# EAGLE schematic Display-Board_Rack-PDU_1.0 (EAGLE 9.6.2)
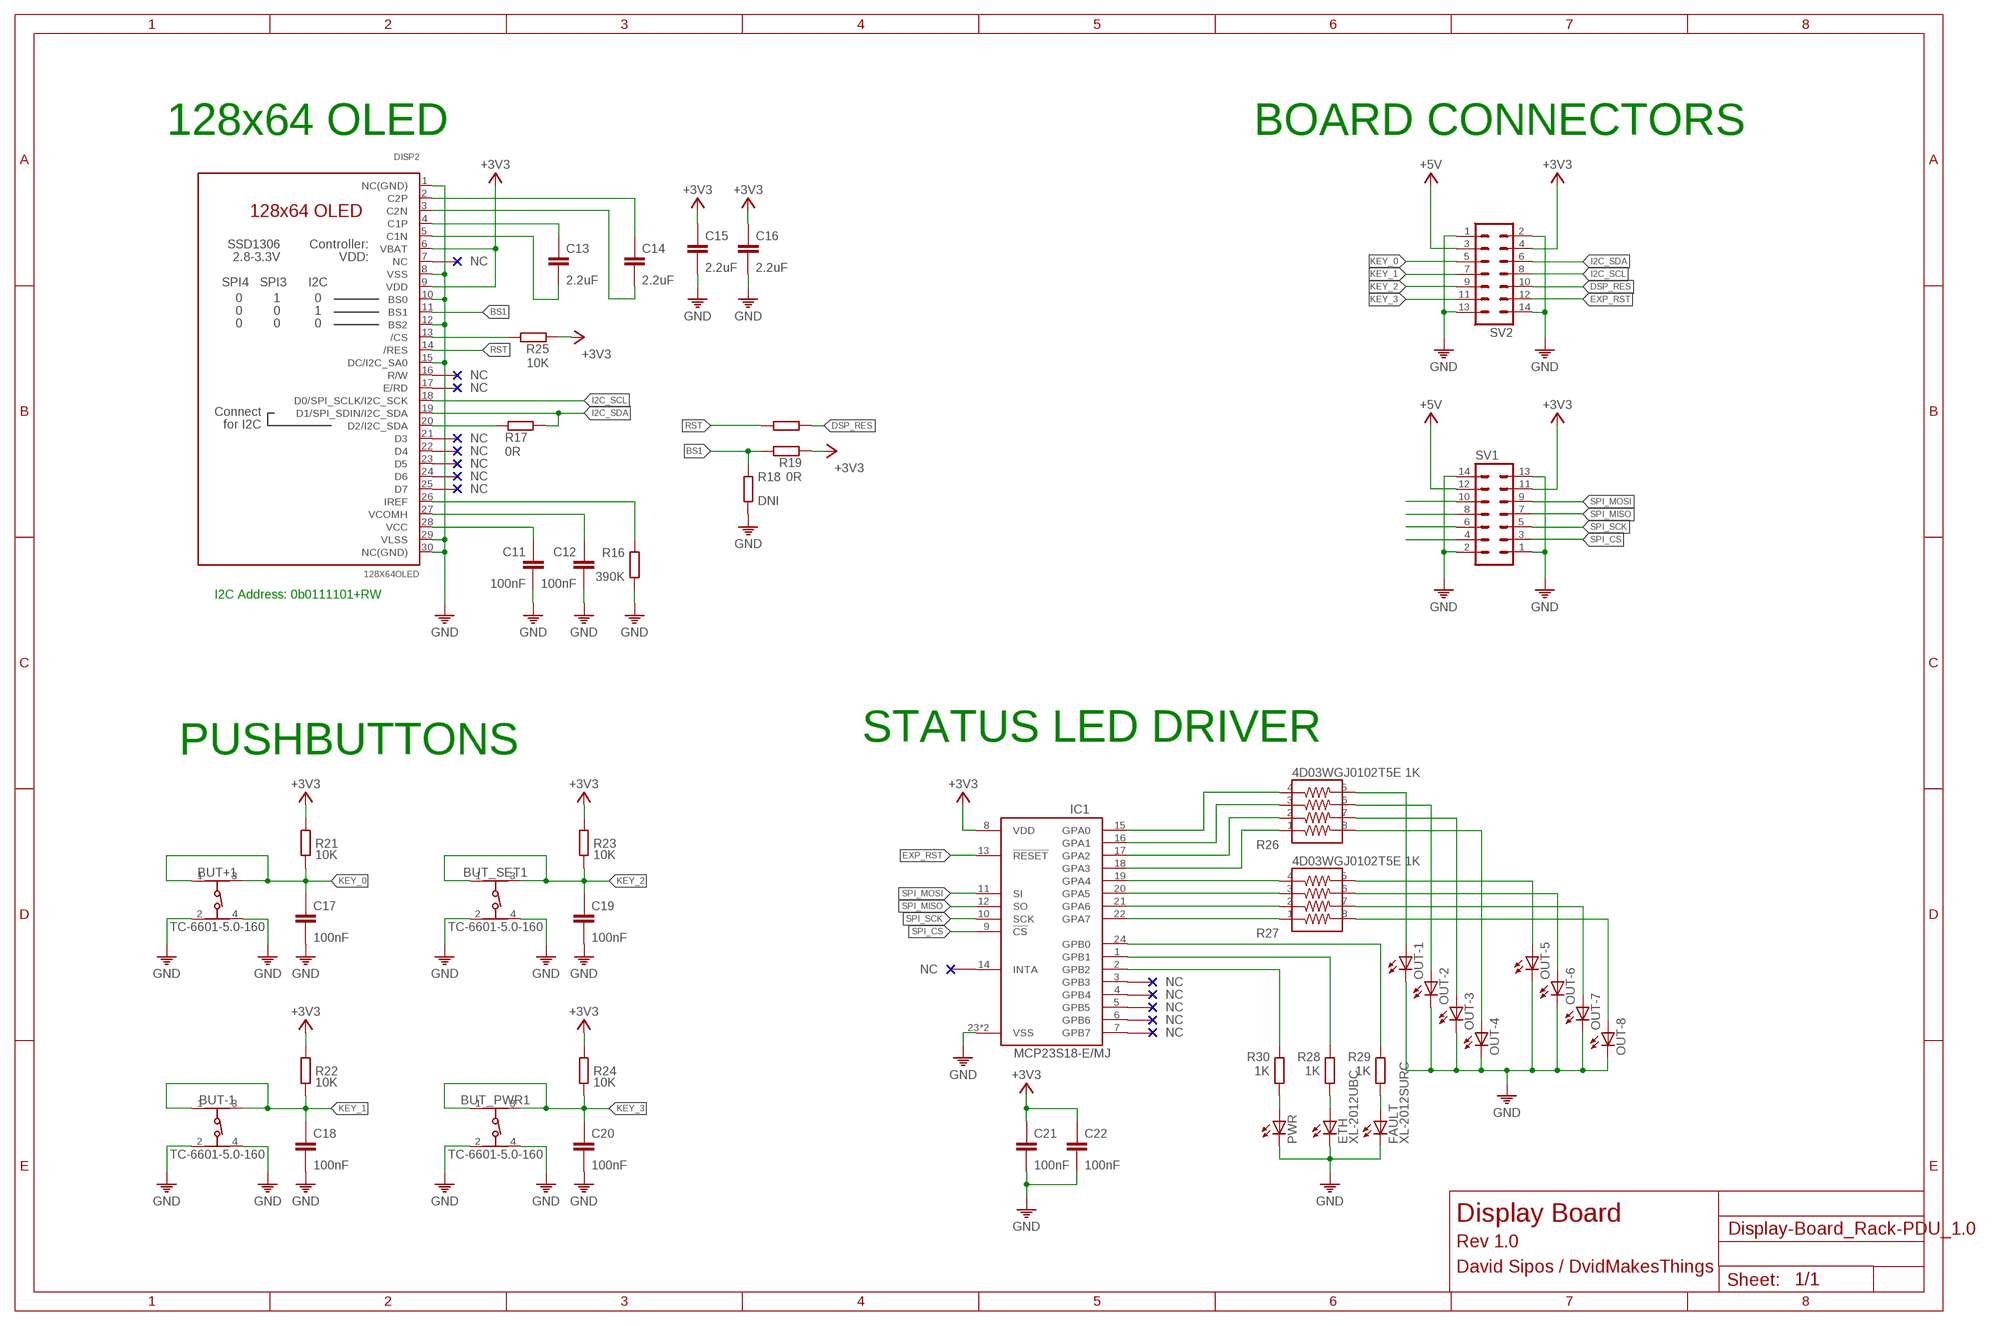
[diagram p0: schematic, sheet 1]

## Parts
BUT+1  TC-6601-5.0-160  430182043816  [430182043816]
BUT-1  TC-6601-5.0-160  430182043816  [430182043816]
BUT_PWR1  TC-6601-5.0-160  430182043816  [430182043816]
BUT_SET1  TC-6601-5.0-160  430182043816  [430182043816]
C11  100nF  C0402  [0402]
C12  100nF  C0402  [0402]
C13  2.2uF  C0402  [0402]
C14  2.2uF  C0402  [0402]
C15  2.2uF  C0402  [0402]
C16  2.2uF  C0402  [0402]
C17  100nF  C0402  [0402]
C18  100nF  C0402  [0402]
C19  100nF  C0402  [0402]
C20  100nF  C0402  [0402]
C21  100nF  C0402  [0402]
C22  100nF  C0402  [0402]
DISP2  128X64OLED  [UG2864]
ETH  XL-2012UBC  LEDCHIP-LED0805  [CHIP-LED0805]
FAULT  XL-2012SURC  LEDCHIP-LED0805  [CHIP-LED0805]
IC1  MCP23S18-E/MJ  MCP23S18  [QFN50P400X400X100-25T265]
OUT-1  LEDCHIP-LED0805  [CHIP-LED0805]
OUT-2  LEDCHIP-LED0805  [CHIP-LED0805]
OUT-3  LEDCHIP-LED0805  [CHIP-LED0805]
OUT-4  LEDCHIP-LED0805  [CHIP-LED0805]
OUT-5  LEDCHIP-LED0805  [CHIP-LED0805]
OUT-6  LEDCHIP-LED0805  [CHIP-LED0805]
OUT-7  LEDCHIP-LED0805  [CHIP-LED0805]
OUT-8  LEDCHIP-LED0805  [CHIP-LED0805]
PWR  LEDCHIP-LED0805  [CHIP-LED0805]
R16  390K  R0402  [0402]
R17  0R  R0402  [0402]
R18  DNI  R0402  [0402]
R19  0R  R0402  [0402]
R20  0R  R0402  [0402]
R21  10K  R0402  [0402]
R22  10K  R0402  [0402]
R23  10K  R0402  [0402]
R24  10K  R0402  [0402]
R25  10K  R0402  [0402]
R26  4D03WGJ0102T5E 1K  742C083103JP  [742C083103JP]
R27  4D03WGJ0102T5E 1K  742C083103JP  [742C083103JP]
R28  1K  R0402  [0402]
R29  1K  R0402  [0402]
R30  1K  R0402  [0402]
SV1  MA07-2W  [MA07-2W]
SV2  MA07-2W  [MA07-2W]

## Nets
+3V3: C15.1 C16.1 C21.1 C22.1 DISP2.6(VBAT) DISP2.9(VDD) IC1.8(VDD) R19.1 R21.1 R22.1 R23.1 R24.1 R25.1 SV1.11 SV2.4
+5V: SV1.12 SV2.3
BS1: DISP2.11(BS1) R18.1 R19.2
DSP_RES: R20.2 SV2.10
EXP_RST: IC1.13(!RESET) SV2.12
GND: BUT+1.2 BUT+1.4 BUT-1.2 BUT-1.4 BUT_PWR1.2 BUT_PWR1.4 BUT_SET1.2 BUT_SET1.4 C11.2 C12.2 C15.2 C16.2 C17.2 C18.2 C19.2 C20.2 C21.2 C22.2 DISP2.1(NC(GND)) DISP2.8(VSS) DISP2.10(BS0) DISP2.12(BS2) DISP2.15(DC/I2C_SA0) DISP2.29(VLSS) DISP2.30(NC(GND)) ETH.C FAULT.C IC1.23(VSS) IC1.25(VSS) OUT-1.C OUT-2.C OUT-3.C OUT-4.C OUT-5.C OUT-6.C OUT-7.C OUT-8.C PWR.C R16.2 R18.2 SV1.1 SV1.2 SV1.13 SV1.14 SV2.1 SV2.2 SV2.13 SV2.14
I2C_SCL: DISP2.18(D0/SPI_SCLK/I2C_SCK) SV2.8
I2C_SDA: DISP2.19(D1/SPI_SDIN/I2C_SDA) R17.2 SV2.6
KEY_0: BUT+1.1 BUT+1.3 C17.1 R21.2 SV2.5
KEY_1: BUT-1.1 BUT-1.3 C18.1 R22.2 SV2.7
KEY_2: BUT_SET1.1 BUT_SET1.3 C19.1 R23.2 SV2.9
KEY_3: BUT_PWR1.1 BUT_PWR1.3 C20.1 R24.2 SV2.11
N$22: C13.2 DISP2.5(C1N)
N$35: C13.1 DISP2.4(C1P)
N$36: C14.2 DISP2.3(C2N)
N$37: C14.1 DISP2.2(C2P)
N$38: DISP2.26(IREF) R16.1
N$39: C11.1 DISP2.28(VCC)
N$40: C12.1 DISP2.27(VCOMH)
N$41: DISP2.20(D2/I2C_SDA) R17.1
N$42: SV1.10
N$43: SV1.8
N$44: SV1.6
N$45: SV1.4
N$46: IC1.1(GPB1) R28.1
N$47: IC1.2(GPB2) R30.1
N$48: IC1.24(GPB0) R29.1
N$49: DISP2.13(/CS) R25.2
N$50: IC1.15(GPA0) R26.4
N$51: IC1.16(GPA1) R26.3
N$52: IC1.17(GPA2) R26.2
N$53: IC1.18(GPA3) R26.1
N$54: IC1.19(GPA4) R27.4
N$55: IC1.20(GPA5) R27.3
N$56: IC1.21(GPA6) R27.2
N$57: IC1.22(GPA7) R27.1
N$58: OUT-1.A R26.5
N$59: OUT-2.A R26.6
N$60: OUT-3.A R26.7
N$61: OUT-4.A R26.8
N$62: OUT-5.A R27.5
N$63: OUT-6.A R27.6
N$64: OUT-7.A R27.7
N$65: OUT-8.A R27.8
N$66: FAULT.A R29.2
N$67: ETH.A R28.2
N$68: PWR.A R30.2
RST: DISP2.14(/RES) R20.1
SPI_CS: IC1.9(!CS) SV1.3
SPI_MISO: IC1.12(SO) SV1.7
SPI_MOSI: IC1.11(SI) SV1.9
SPI_SCK: IC1.10(SCK) SV1.5
Unconnected: DISP2.7(NC) DISP2.16(R/W) DISP2.17(E/RD) DISP2.21(D3) DISP2.22(D4) DISP2.23(D5) DISP2.24(D6) DISP2.25(D7) IC1.3(GPB3) IC1.4(GPB4) IC1.5(GPB5) IC1.6(GPB6) IC1.7(GPB7) IC1.14(INTA)

## Notes on the sheet
- 128x64 OLED | BOARD CONNECTORS
- I2C Address: 0b0111101+RW
- PUSHBUTTONS | STATUS LED DRIVER
- Display Board
- Rev 1.0
- David Sipos / DvidMakesThings

## Library data of the parts
BUT+1 BUT-1 BUT_PWR1 BUT_SET1 = Wurth_Switch_WS-TASV:430182043816: WS-TASV SMT Tact Switch 6x6 mm Material Properties Cover Material : Stainless Steel Properties Actuator Material:LCP Actuator Flammability :UL94 V-0 Rating Actuator Color:Black; Salmon; White Frame Material:LCP Flammability Rating:UL94 V-0 Frame Color:Black Contact Material:Stainless Steel Contact Plating:Silver Terminal Material:Copper Alloy Terminal Plating:Silver VR:12 V (DC) Contact Resistance Initial:100 mΩ Contact Resistance After Life Test:2Ω RISO:100 MΩ Withstanding Voltage:250 V (AC) Washable:No Qty.:4000;5000 Mechanical Properties Electrical Life:400; 550; 1000 Stroke :0.25 mm General Information Operating Temperature:-40 up to +85 °C Washable:No Packaging Properties Packaging:Tape and Reel <https://www.we-online.com/catalog/media/o37470v209%20Family_WS-TASV_6x6mm_SMD_Tact_Switch_4301820xx8xx.jpg> Details see: https://www.we-online.com/catalog/en/TASV_6X6_SMD/ Updated by yingchun,Shan;2020-02-18 2020(C) Würth Elektronik; DATASHEET-URL: https://www.we-online.com/redexpert/spec/430182043816?ae; HEIGHT: 4.3mm; OPERATION-FORCE: 160g; PART-NUMBER: 430182043816; QTY: 1000; VALUE: 430182043816
C11-C22 = ds_passive:C
DISP2 = ds_displays:128X64OLED: 128x64 OLED
ETH FAULT OUT-1-OUT-8 PWR = led:LED: LED OSRAM: - CHIPLED LG R971, LG N971, LY N971, LG Q971, LY Q971, LO R971, LY R971 LH N974, LH R974 LS Q976, LO Q976, LY Q976 LO Q996 - Hyper CHIPLED LW Q18S LB Q993, LB Q99A, LB R99A - SideLED LS A670, LO A670, LY A670, LG A670, LP A670 LB A673, LV A673, LT A673, LW A673 LH A674 LY A675 LS A676, LA A676, LO A676, LY A676, LW A676 LS A679, LY A679, LG A679 - Hyper Micro SIDELED® LS Y876, LA Y876, LO Y876, LY Y876 LT Y87S - SmartLED LW L88C, LW L88S LB L89C, LB L89S, LG L890 LS L89K, LO L89K, LY L89K LS L896, LA L896, LO L896, LY L896 - TOPLED LS T670, LO T670, LY T670, LG T670, LP T670 LSG T670, LSP T670, LSY T670, LOP T670, LYG T670 LG T671, LOG T671, LSG T671 LB T673, LV T673, LT T673, LW T673 LH T674 LS T676, LA T676, LO T676, LY T676, LB T676, LH T676, LSB T676, LW T676 LB T67C, LV T67C, LT T67C, LS T67K, LO T67K, LY T67K, LW E67C LS E67B, LA E67B, LO E67B, LY E67B, LB E67C, LV E67C, LT E67C LW T67C LS T679, LY T679, LG T679 LS T770, LO T770, LY T770, LG T770, LP T770 LB T773, LV T773, LT T773, LW T773 LH T774 LS E675, LA E675, LY E675, LS T675 LS T776, LA T776, LO T776, LY T776, LB T776 LHGB T686 LT T68C, LB T68C - Hyper Mini TOPLED® LB M676 - Mini TOPLED Santana® LG M470 LS M47K, LO M47K, LY M47K Source: http://www.osram.convergy.de LUXEON: - LUMILED® LXK2-PW12-R00, LXK2-PW12-S00, LXK2-PW14-U00, LXK2-PW14-V00 LXK2-PM12-R00, LXK2-PM12-S00, LXK2-PM14-U00 LXK2-PE12-Q00, LXK2-PE12-R00, LXK2-PE12-S00, LXK2-PE14-T00, LXK2-PE14-U00 LXK2-PB12-K00, LXK2-PB12-L00, LXK2-PB12-M00, LXK2-PB14-N00, LXK2-PB14-P00, LXK2-PB14-Q00 LXK2-PR12-L00, LXK2-PR12-M00, LXK2-PR14-Q00, LXK2-PR14-R00 LXK2-PD12-Q00, LXK2-PD12-R00, LXK2-PD12-S00 LXK2-PH12-R00, LXK2-PH12-S00 LXK2-PL12-P00, LXK2-PL12-Q00, LXK2-PL12-R00 Source: www.luxeon.com KINGBRIGHT: KA-3528ASYC Source: www.kingbright.com
IC1 = ds_ic_peripherals:MCP23S18: 16-Bit I/O Expander with Open-Drain Outputs
R16-R25 R28-R30 = ds_passive:R
R26 R27 = Resistor Array:742C083103JP: RES ARRAY 4 RES 10K OHM 1206 Manufacturer's datasheet <https://www.ctscorp.com/wp-content/uploads/74x.pdf>; CREATED_BY: PCBLayout.com; DIGIKEY_PN: 742C083103JPTR-ND; MANUFACTURER: CTS Resistor Products; MPN: 742C083103JP; PACKAGE: 1206
SV1 SV2 = con-lstb:MA07-2W: PIN HEADER; OC_FARNELL: unknown; OC_NEWARK: unknown